# EAGLE schematic ind_pwm_gen (EAGLE 9.0.1)
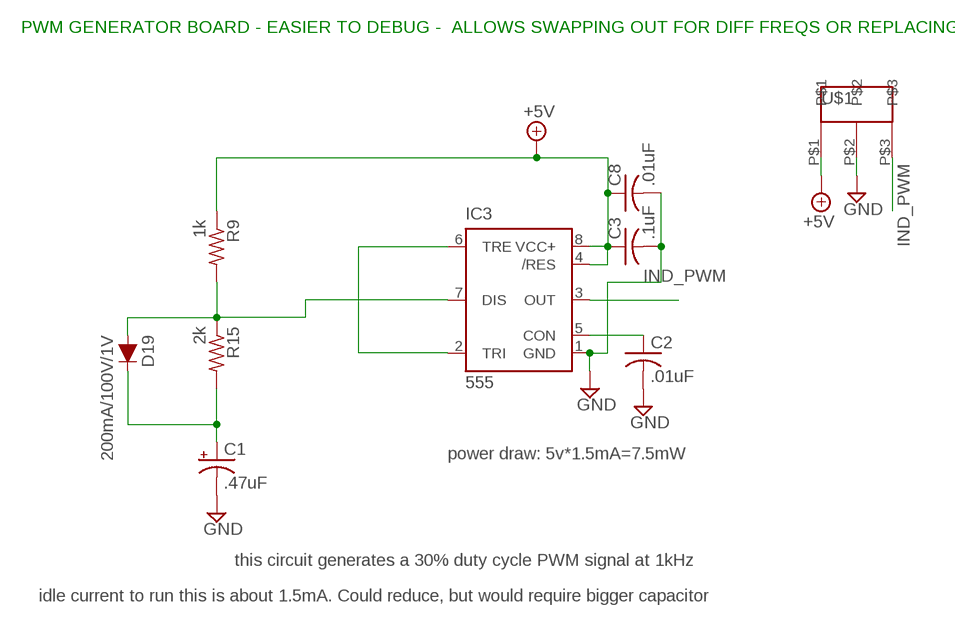
[diagram p0: schematic, sheet 1]

## Parts
C1  .47uF  CPOL-USE2-4  [E2-4]
C2  .01uF  C-US025-030X050  [C025-030X050]
C3  .1uF  C-US025-030X050  [C025-030X050]
C8  .01uF  C-US025-030X050  [C025-030X050]
D19  200mA/100V/1V  DIODE-1N4148  [DIODE-1N4148]
IC3  555  555P  [DIP08]
R9  1k  R-US_0204/7  [0204/7]
R15  2k  R-US_0204/7  [0204/7]
U$1  3-PIN-HEADER  [3-PIN-HEADER]

## Nets
+5V: C3.1 C8.1 IC3.4(/RES) IC3.8(VCC+) R9.1 U$1.P$1
GND: C1.- C2.2 C3.2 C8.2 IC3.1(GND) U$1.P$2
IND_PWM: IC3.3(OUT) U$1.P$3
N$59: IC3.2(TRI) IC3.6(TRE)
N$60: D19.A IC3.7(DIS) R9.2 R15.1
N$61: C2.1 IC3.5(CON)
N$62: C1.+ D19.C R15.2

## Notes on the sheet
- PWM GENERATOR BOARD - EASIER TO DEBUG -  ALLOWS SWAPPING OUT FOR DIFF FREQS OR REPLACING LATER
- power draw: 5v*1.5mA=7.5mW
- this circuit generates a 30% duty cycle PWM signal at 1kHz
- idle current to run this is about 1.5mA. Could reduce, but would require bigger capacitor

## Library data of the parts
C1 = rcl:CPOL-US: POLARIZED CAPACITOR, American symbol; SPICEPREFIX: C
C2 C3 C8 = rcl:C-US: CAPACITOR, American symbol; SPICEPREFIX: C
D19 = SparkFun-DiscreteSemi:DIODE: Diode These are standard reverse protection diodes and small signal diodes. SparkFun Products: SparkFun SparkPunk Sound Kit <https://www.sparkfun.com/products/11177> SparkFun ESP8266 Thing <https://www.sparkfun.com/products/13231>; PROD_ID: DIO-08378
IC3 = SparkFun-IC-Special-Function:555: General purpose bipolar Timer Datasheet <http://www.sparkfun.com/datasheets/Components/General/ne555.pdf> SparkFun Products SparkFun SparkPunk Sequencer Kit <https://www.sparkfun.com/products/12707> (KIT-12707) Storefront Component: 555 Timer <https://www.sparkfun.com/products/9273> (COM-09273) Two parts valid for production: VFP: IC-11930 (M7555 PTH) VFP: IC-09173 (555 PTH) - Preferred; PROD_ID: IC-09173; PROD_ID_ALT: IC-09173
R9 R15 = rcl:R-US_: RESISTOR, American symbol; SPICEPREFIX: R
U$1 = mask_lbr:3-PIN-HEADER

## Net classes
0 default: width 0.508 mm, drill 0.254 mm, clearance 0.305 mm